# Altium project W2-HF_AMP.PrjPcb
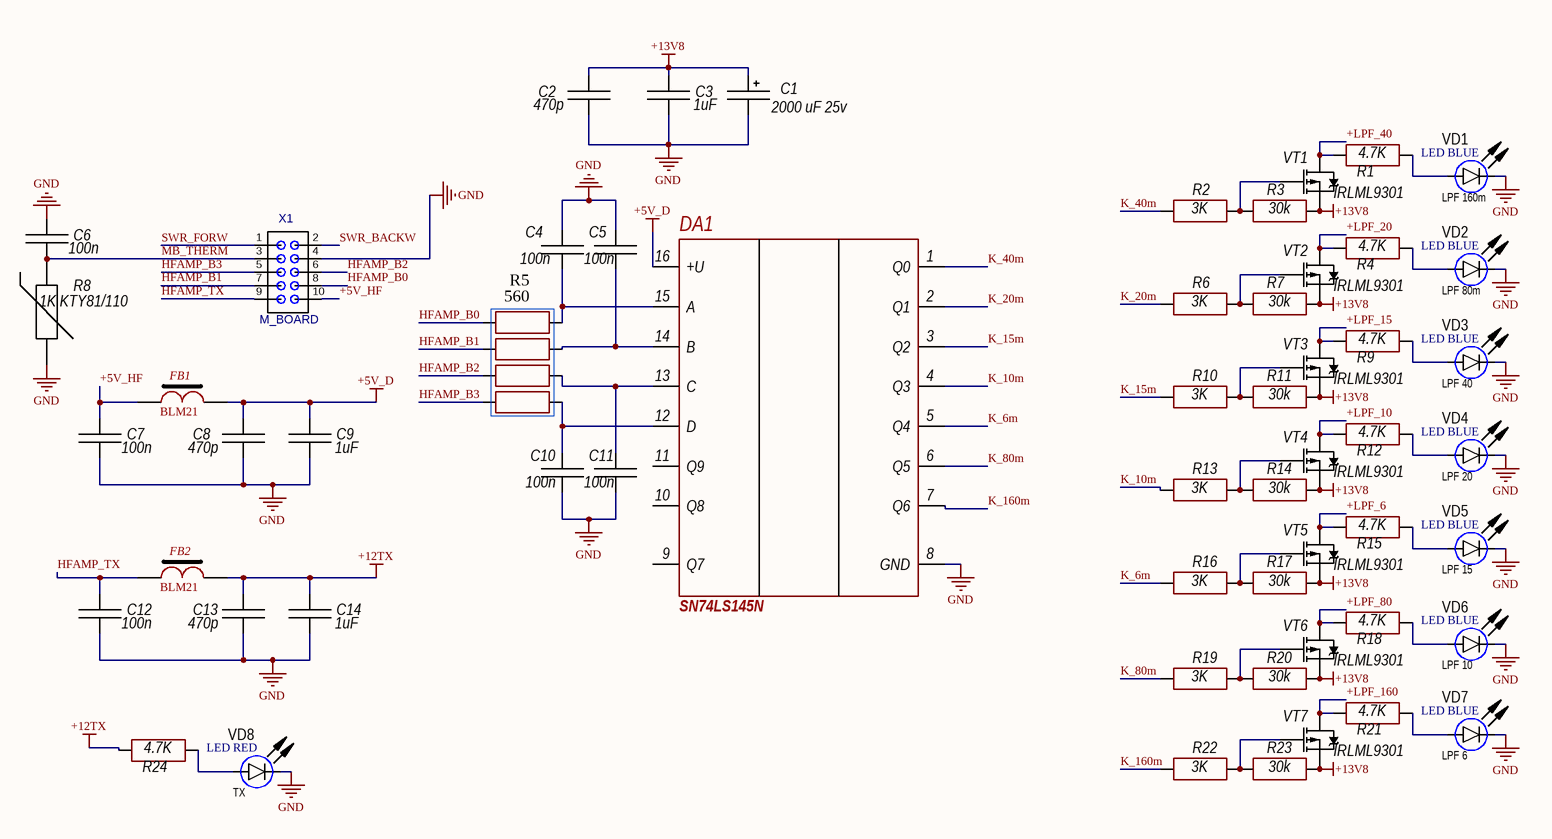
[diagram p0: HF_Control.SchDoc]
3 sheets, 274 parts. Net scope: global (net labels, ports and power ports of the same name join across sheets).
Board file: PCB_HFAmp.PcbDoc
Sheets:
  HF_Control.SchDoc
  HF_Amp.SchDoc
  HF_LPF.SchDoc

## Sheet HF_Control.SchDoc
size 420 x 297 mm; Date: 28.01.2023; ApprovedBy: UA3REO; CheckedBy: UA3REO; Author: RU4PN; CompanyName: Wolf Team; DocumentNumber: Wolf2 - HF Amp - Control; SheetNumber: 1; SheetTotal: 3

### Parts
C1  2000 uF 25v  [D13C5H20]
C2  470p  [CH0805C]
C3  1uF  [CH0805C]
C4  100n  [CH0805C]
C5  100n  [CH0805C]
C6  100n  [CH0805C]
C7  100n  [CH0805C]
C8  470p  [CH0805C]
C9  1uF  [CH0805C]
C10  100n  [CH0805C]
C11  100n  [CH0805C]
C12  100n  [CH0805C]
C13  470p  [CH0805C]
C14  1uF  [CH0805C]
DA1  SN74LS145N  [16-SOP]
FB1  BLM21  [CH0805L]
FB2  BLM21  [CH0805L]
R1  4.7K  [CH0805R]
R2  3K  [CH0805R]
R3  30k  [CH0805R]
R4  4.7K  [CH0805R]
R5  560  [CAT16]
R6  3K  [CH0805R]
R7  30k  [CH0805R]
R8  1K KTY81/110  [CON: PBS-2]
R9  4.7K  [CH0805R]
R10  3K  [CH0805R]
R11  30k  [CH0805R]
R12  4.7K  [CH0805R]
R13  3K  [CH0805R]
R14  30k  [CH0805R]
R15  4.7K  [CH0805R]
R16  3K  [CH0805R]
R17  30k  [CH0805R]
R18  4.7K  [CH0805R]
R19  3K  [CH0805R]
R20  30k  [CH0805R]
R21  4.7K  [CH0805R]
R22  3K  [CH0805R]
R23  30k  [CH0805R]
R24  4.7K  [CH0805R]
VD1  LED BLUE  Color: LPF 160m  [LED: 0805B]
VD2  LED BLUE  Color: LPF 80m  [LED: 0805B]
VD3  LED BLUE  Color: LPF 40  [LED: 0805B]
VD4  LED BLUE  Color: LPF 20  [LED: 0805B]
VD5  LED BLUE  Color: LPF 15  [LED: 0805B]
VD6  LED BLUE  Color: LPF 10  [LED: 0805B]
VD7  LED BLUE  Color: LPF 6  [LED: 0805B]
VD8  LED RED  Color: TX  [LED: 0805R]
VT1  IRLML9301  [SOT23_132]
VT2  IRLML9301  [SOT23_132]
VT3  IRLML9301  [SOT23_132]
VT4  IRLML9301  [SOT23_132]
VT5  IRLML9301  [SOT23_132]
VT6  IRLML9301  [SOT23_132]
VT7  IRLML9301  [SOT23_132]
X1  M_BOARD  [CON: BH-10]

### Nets
+5V_D: C8.1 C9.1 DA1.16(+U) FB1.1
+12TX: C13.1 C14.1 FB2.1 R24.2
+13V8: C1.1 C2.1 C3.1 R3.1 R7.1 R11.1 R14.1 R17.1 R20.1 R23.1 VT1.2(S) VT2.2(S) VT3.2(S) VT4.2(S) VT5.2(S) VT6.2(S) VT7.2(S)
GND: C1.2 C2.2 C3.2 C4.1 C5.1 C6.1 C7.2 C8.2 C9.2 C10.2 C11.2 C12.2 C13.2 C14.2 DA1.8(GND) R8.1 VD1.2(C) VD2.2(C) VD3.2(C) VD4.2(C) VD5.2(C) VD6.2(C) VD7.2(C) VD8.2(C) X1.4
+5V_HF: C7.1 FB1.2 X1.10
+LPF_6: R15.2 VT5.3(D)
+LPF_10: R12.2 VT4.3(D)
+LPF_15: R9.2 VT3.3(D)
+LPF_20: R4.2 VT2.3(D)
+LPF_40: R1.2 VT1.3(D)
+LPF_80: R18.2 VT6.3(D)
+LPF_160: R21.2 VT7.3(D)
HFAMP_B0: R5.1 X1.8
HFAMP_B1: R5.2 X1.7
HFAMP_B2: R5.3 X1.6
HFAMP_B3: R5.4 X1.5
HFAMP_TX: C12.1 FB2.2 X1.9
K_6m: DA1.5(Q4) R16.2
K_10m: DA1.4(Q3) R13.2
K_15m: DA1.3(Q2) R10.2
K_20m: DA1.2(Q1) R6.2
K_40m: DA1.1(Q0) R2.2
K_80m: DA1.6(Q5) R19.2
K_160m: DA1.7(Q6) R22.2
MB_THERM: C6.2 R8.2 X1.3
SWR_BACKW: X1.2
SWR_FORW: X1.1
NetC4_2: C4.2 DA1.15(A) R5.5
NetC5_2: C5.2 DA1.14(B) R5.6
NetC10_1: C10.1 DA1.12(D) R5.8
NetC11_1: C11.1 DA1.13(C) R5.7
NetR1_1: R1.1 VD1.1(A)
NetR2_1: R2.1 R3.2 VT1.1(G)
NetR4_1: R4.1 VD2.1(A)
NetR6_1: R6.1 R7.2 VT2.1(G)
NetR9_1: R9.1 VD3.1(A)
NetR10_1: R10.1 R11.2 VT3.1(G)
NetR12_1: R12.1 VD4.1(A)
NetR13_1: R13.1 R14.2 VT4.1(G)
NetR15_1: R15.1 VD5.1(A)
NetR16_1: R16.1 R17.2 VT5.1(G)
NetR18_1: R18.1 VD6.1(A)
NetR19_1: R19.1 R20.2 VT6.1(G)
NetR21_1: R21.1 VD7.1(A)
NetR22_1: R22.1 R23.2 VT7.1(G)
NetR24_1: R24.1 VD8.1(A)

Not connected (* = marked no-connect by the designer): DA1 9(Q7) 10(Q8) 11(Q9)

### Notes on the sheet
- Подп. и дата
- Инв. № дубл.
- Взам. инв. №
- Инв. № подл.
- Изм.
- Лист
- № докум.
- Подп.
- Дата
- 2.106-A3
- Копировал
- Формат А3

### Library data of the parts
C1 = AlumCap: Manufacturer: *; Model: *; HelpURL: *; ComponentKind: *; Value: *
C2-C14 = Capacitor: Manufacturer: *; Model: *; HelpURL: *; ComponentKind: *; Value: *
FB1 FB2 = FB-1
R1-R4 R6 R7 R9-R24 = Resistor: Manufacturer: *; Model: *; HelpURL: *; ComponentKind: *; Value: *
R5 = CAT10-0804
R8 = NTC: Manufacturer: *; Model: *; HelpURL: *; ComponentKind: *; Value: *
VD1-VD8 = LED_single: ValueManufacturerPartNumber: LED, *, *, *, -55...+150°C; Manufacturer: *; Package: *; HelpURL: *; Temperature: -55...+150°C; TypeDiode: LED; Current: *; VoltageDrop: *; PartNumber: *
VT1-VT7 = IRLML9301: Mosfet; Model: *; Manufacturer: *; ComponentKind: *; HelpURL: *
X1 = IDC10: 2*5 Pin

## Sheet HF_Amp.SchDoc
size 420 x 297 mm; Date: 28.01.2023; ApprovedBy: UA3REO; CheckedBy: UA3REO; Author: RU4PN; CompanyName: Wolf Team; DrawnBy: UA3REO; DocumentNumber: Wolf2 - HF Amp - Amp; SheetNumber: 2; SheetTotal: 3
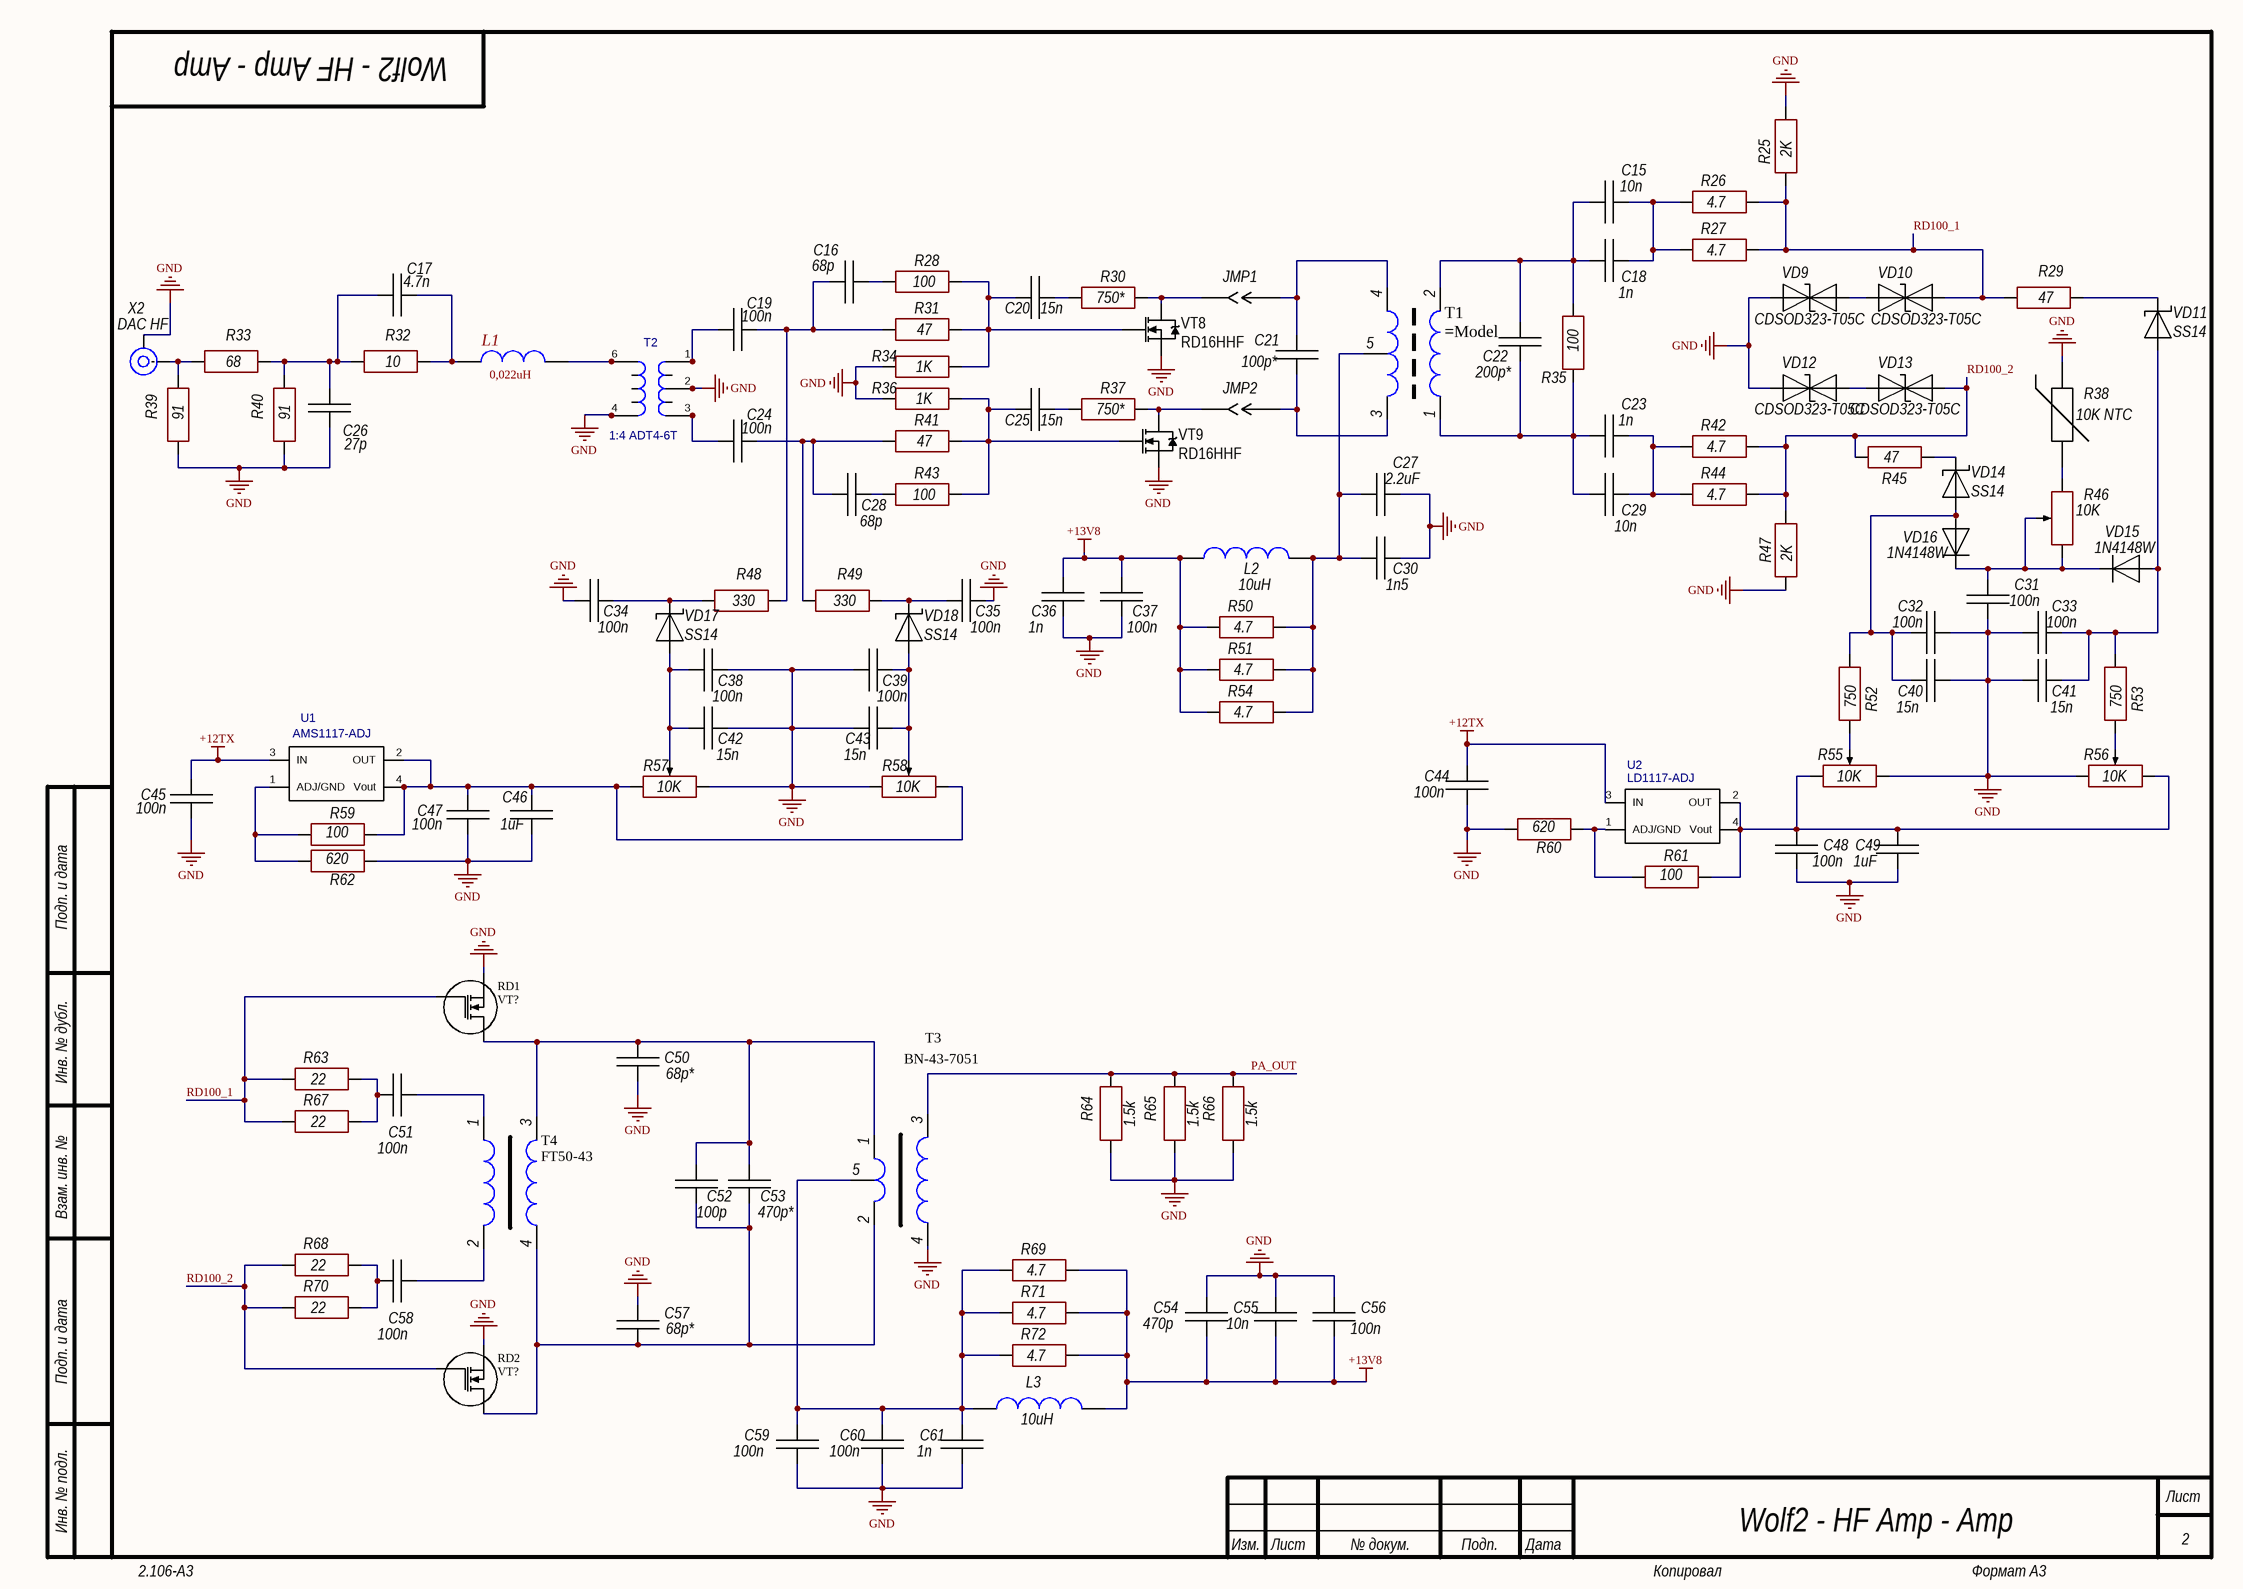
[diagram p1: HF_Amp.SchDoc]

### Parts
C15  10n  [CH1210C]
C16  68p  [CH0805C]
C17  4.7n  [CH0805C]
C18  1n  [CH1210C]
C19  100n  [CH0805C]
C20  15n  [CH1206C]
C21  100p*  [CH1210C]
C22  200p*  [CH1812C]
C23  1n  [CH1210C]
C24  100n  [CH0805C]
C25  15n  [CH1206C]
C26  27p  [CH0805C]
C27  2.2uF  [CH1206C]
C28  68p  [CH0805C]
C29  10n  [CH1210C]
C30  1n5  [CH1206C]
C31  100n  [CH0805C]
C32  100n  [CH0805C]
C33  100n  [CH0805C]
C34  100n  [CH0805C]
C35  100n  [CH0805C]
C36  1n  [CH0805C]
C37  100n  [CH0805C]
C38  100n  [CH0805C]
C39  100n  [CH0805C]
C40  15n  [CH0805C]
C41  15n  [CH0805C]
C42  15n  [CH0805C]
C43  15n  [CH0805C]
C44  100n  [CH0805C]
C45  100n  [CH0805C]
C46  1uF  [CH0805C]
C47  100n  [CH0805C]
C48  100n  [CH0805C]
C49  1uF  [CH0805C]
C50  68p*  [CH1206ATC]
C51  100n  [CH1210C]
C52  100p  [CH1812C]
C53  470p*  [CH1812C]
C54  470p  [CH1206C]
C55  10n  [CH1206C]
C56  100n  [CH1206C]
C57  68p*  [CH1206ATC]
C58  100n  [CH1210C]
C59  100n  [CH1206C]
C60  100n  [CH1206C]
C61  1n  [CH1206C]
JMP1  Jumper_2  [CON: JUMPER_2]  (value not drawn)
JMP2  Jumper_2  [CON: JUMPER_2]  (value not drawn)
L1  0,022uH  [CH1210L]
L2  10uH  [IND: R24]
L3  10uH  [IND: R24]
R25  2K  [CH2512R]
R26  4.7  [CH2512R]
R27  4.7  [CH2512R]
R28  100  [CH0805R]
R29  47  [CH0805R]
R30  750*  [CH1206R]
R31  47  [CH0805R]
R32  10  [CH0805R]
R33  68  [CH0805R]
R34  1K  [CH0805R]
R35  100  [CH2512R]
R36  1K  [CH0805R]
R37  750*  [CH1206R]
R38  10K NTC  [CON: PBS-2]
R39  91  [CH0805R]
R40  91  [CH0805R]
R41  47  [CH0805R]
R42  4.7  [CH2512R]
R43  100  [CH0805R]
R44  4.7  [CH2512R]
R45  47  [CH0805R]
R46  10K  [RES: 3296W]
R47  2K  [CH2512R]
R48  330  [CH0805R]
R49  330  [CH0805R]
R50  4.7  [CH2512R]
R51  4.7  [CH2512R]
R52  750  [CH0805R]
R53  750  [CH0805R]
R54  4.7  [CH2512R]
R55  10K  [RES: 3296W]
R56  10K  [RES: 3296W]
R57  10K  [RES: 3296W]
R58  10K  [RES: 3296W]
R59  100  [CH0805R]
R60  620  [CH0805R]
R61  100  [CH0805R]
R62  620  [CH0805R]
R63  22  [CH2512R]
R64  1.5k  [R-DIP]
R65  1.5k  [R-DIP]
R66  1.5k  [R-DIP]
R67  22  [CH2512R]
R68  22  [CH2512R]
R69  4.7  [CH2512R]
R70  22  [CH2512R]
R71  4.7  [CH2512R]
R72  4.7  [CH2512R]
RD1  VT?  [RD100]
RD2  VT?  [RD100]
T1  (no value)  [BN43-202-RD16]
T2  1:4 ADT4-6T  [TRANSF_ACORE2]
T3  BN-43-7051  [BN61-002-V1]
T4  FT50-43  [TRANS OS W2]
U1  value AMS1117-ADJ  [LT1117CST-3.3]  (hidden comment: 1117-ADJ)
U2  value LD1117-ADJ  [LT1117CST-3.3_2]  (hidden comment: 1117-ADJ)
VD9  CDSOD323-T05C  [SOD323]
VD10  CDSOD323-T05C  [SOD323]
VD11  SS14  [SMA]
VD12  CDSOD323-T05C  [SOD323]
VD13  CDSOD323-T05C  [SOD323]
VD14  SS14  [SMA]
VD15  1N4148W  [SOD123]
VD16  1N4148W  [SOD123]
VD17  SS14  [SMA]
VD18  SS14  [SMA]
VT8  PartNumber: RD16HHF  [rd16]
VT9  PartNumber: RD16HHF  [rd16]
X2  DAC HF  [CON: SMA]

### Nets
+12TX: C44.1 C45.1 U1.3(IN) U2.3(IN)
+13V8: C36.1 C37.1 C54.1 C55.1 C56.1 L2.2 L3.1 R50.2 R51.2 R54.2 R69.1 R71.1 R72.1
GND: C26.1 C27.2 C30.2 C31.2 C32.1 C33.2 C34.2 C35.1 C36.2 C37.2 C38.1 C39.2 C40.1 C41.2 C42.1 C43.2 C44.2 C45.2 C46.2 C47.2 C48.2 C49.2 C50.1 C54.2 C55.2 C56.2 C57.2 C59.1 C60.1 C61.1 R25.1 R34.2 R36.2 R38.2 R39.2 R40.2 R47.2 R55.3 R56.1 R57.3 R58.1 R60.2 R62.1 R64.1 R65.1 R66.1 RD1.2(S) RD2.2(S) T2.2(S2) T2.4(P1) T2.8 T2.11 T3.4 VD9.1(A) VD12.1(A) VT8.2(S) VT9.2(S) X2.2(IN)
PA_OUT: R64.2 R65.2 R66.2 T3.3
RD100_1: R25.2 R26.1 R27.1 R29.2 R63.2 R67.2 RD1.3(G) VD10.2(C)
RD100_2: R42.1 R44.1 R45.1 R47.1 R68.2 R70.2 RD2.3(G) VD13.2(C)
NetC15_1: C15.1 C18.1 C22.1 R35.1 T1.2
NetC15_2: C15.2 C18.2 R26.2 R27.2
NetC16_1: C16.1 R28.2
NetC16_2: C16.2 C19.2 R31.2 R48.1
NetC17_1: C17.1 C26.2 R32.2 R33.1 R40.1
NetC17_2: C17.2 L1.2 R32.1
NetC19_1: C19.1 T2.1(S3) T2.7
NetC20_1: C20.1 R30.2
NetC20_2: C20.2 R28.1 R31.1 R34.1 VT8.1(G)
NetC21_1: C21.1 JMP1.2(OUT) T1.4
NetC21_2: C21.2 JMP2.2(OUT) T1.3
NetC22_2: C22.2 C23.1 C29.1 R35.2 T1.1
NetC23_2: C23.2 C29.2 R42.2 R44.2
NetC24_1: C24.1 T2.3(S1) T2.9
NetC24_2: C24.2 C28.2 R41.2 R49.2
NetC25_1: C25.1 R37.2
NetC25_2: C25.2 R36.1 R41.1 R43.1 VT9.1(G)
NetC27_1: C27.1 C30.1 L2.1 R50.1 R51.1 R54.1 T1.5
NetC28_1: C28.1 R43.2
NetC31_1: C31.1 R46.1 R46.2 VD15.2 VD16.2
NetC32_2: C32.2 C40.2 R52.1 VD14.1 VD16.1
NetC33_1: C33.1 C41.1 R53.1 VD11.1 VD15.1
NetC34_1: C34.1 R48.2 VD17.2
NetC35_2: C35.2 R49.1 VD18.2
NetC38_2: C38.2 C42.2 R57.2 VD17.1
NetC39_1: C39.1 C43.1 R58.2 VD18.1
NetC46_1: C46.1 C47.1 R57.1 R58.3 R59.1 U1.2(OUT) U1.4(Vout)
NetC48_1: C48.1 C49.1 R55.1 R56.3 R61.1 U2.2(OUT) U2.4(Vout)
NetC50_2: C50.2 C52.2 C53.2 RD1.1(D) T3.1 T4.3
NetC51_1: C51.1 R63.1 R67.1
NetC51_2: C51.2 T4.1
NetC52_1: C52.1 C53.1 C57.1 RD2.1(D) T3.2 T4.4
NetC58_1: C58.1 R68.1 R70.1
NetC58_2: C58.2 T4.2
NetC59_2: C59.2 C60.2 C61.2 L3.2 R69.2 R71.2 R72.2 T3.5
NetJMP1_1: JMP1.1(IN) R30.1 VT8.3(D)
NetJMP2_1: JMP2.1(IN) R37.1 VT9.3(D)
NetL1_1: L1.1 T2.6(P2) T2.10
NetR29_1: R29.1 VD11.2
NetR33_2: R33.2 R39.1 X2.1(IN)
NetR38_1: R38.1 R46.3
NetR45_2: R45.2 VD14.2
NetR52_2: R52.2 R55.2
NetR53_2: R53.2 R56.2
NetR59_2: R59.2 R62.2 U1.1(ADJ/GND)
NetR60_1: R60.1 R61.2 U2.1(ADJ/GND)
NetVD9_2: VD9.2(C) VD10.1(A)
NetVD12_2: VD12.2(C) VD13.1(A)

### Notes on the sheet
- Подп. и дата
- Инв. № дубл.
- Взам. инв. №
- Инв. № подл.
- Изм.
- Лист
- № докум.
- Подп.
- Дата
- 2.106-A3
- Копировал
- Формат А3

### Library data of the parts
C15-C61 = Capacitor: Manufacturer: *; Model: *; HelpURL: *; ComponentKind: *; Value: *
JMP1 JMP2 = Jumper_2: Jumper
L1 = Inductor-2
L2 L3 = Inductor ring: Value: {Value}; Model: *; ComponentKind: *; Manufacturer: *; HelpURL: *
R25-R37 R39-R45 R47-R54 R59-R72 = Resistor: Manufacturer: *; Model: *; HelpURL: *; ComponentKind: *; Value: *
R38 = NTC: Manufacturer: *; Model: *; HelpURL: *; ComponentKind: *; Value: *
R46 R55-R58 = ADJ resistor: Manufacturer: *; Model: *; HelpURL: *; ComponentKind: *; Value: *
RD1 = N-1
RD2 = N-1: RD100
T1 = TRANS-RD16
T2 = TRANSF_ACORE2: Transformer; Value: 1:4 ADT4-6T
T3 = BN-43-7051_1
T4 = Trans_L
U1 U2 = LT1117CST-3.3: LT1117CST-ADJ
VD9 VD10 VD12 VD13 = TVS-diod: ComponentKind: *; Manufacturer: *; Model: *; HelpURL: *
VD11 VD14 VD17 VD18 = Diod Schottky: ComponentKind: *; Manufacturer: *; Model: *; HelpURL: *
VD15 VD16 = Diod: ComponentKind: *; Manufacturer: *; Model: *; HelpURL: *
VT8 VT9 = MOSFET_N_132: Manufacturer: Infineon Technologies; ValueManufacturerPartNumber: MOSFET N-channel transistor, 80V, 7A, 9.1nC, 2.5W, 34mOhm, 756pF, 8-TDSON, -55...+150°C; TypeTransistor: MOSFET N-channel transistor; VoltageDS: 80V; CurrentDS: 7A; RDS: 34mOhm; GateCharge: 9.1nC; InputCapacitor: 756pF; MaxPower: 2.5W; Package: 8-TDSON; HelpURL: https://www.digikey.com/product-detail/en/infineon-technologies/BSC340N08NS3GATMA1/BSC340N08NS3GATMA1TR-ND/2080655; Temperature: -55...+150°C
X2 = SMA: RF; Model: *; Manufacturer: *; HelpURL: *; ComponentKind: *

## Sheet HF_LPF.SchDoc: PA HF
size 420 x 297 mm; Date: 19.02.2023; ApprovedBy: UA3REO; CheckedBy: UA3REO; Author: RU4PN; CompanyName: WolfTeam; DrawnBy: UA3REO; Engineer: UA3REO; Address1: 1; Address2: 2; Address3: 3; Address4: 4; DocumentNumber: W2 - HF AMP  - LPF; Revision: 0.1; SheetNumber: 3; SheetTotal: 3
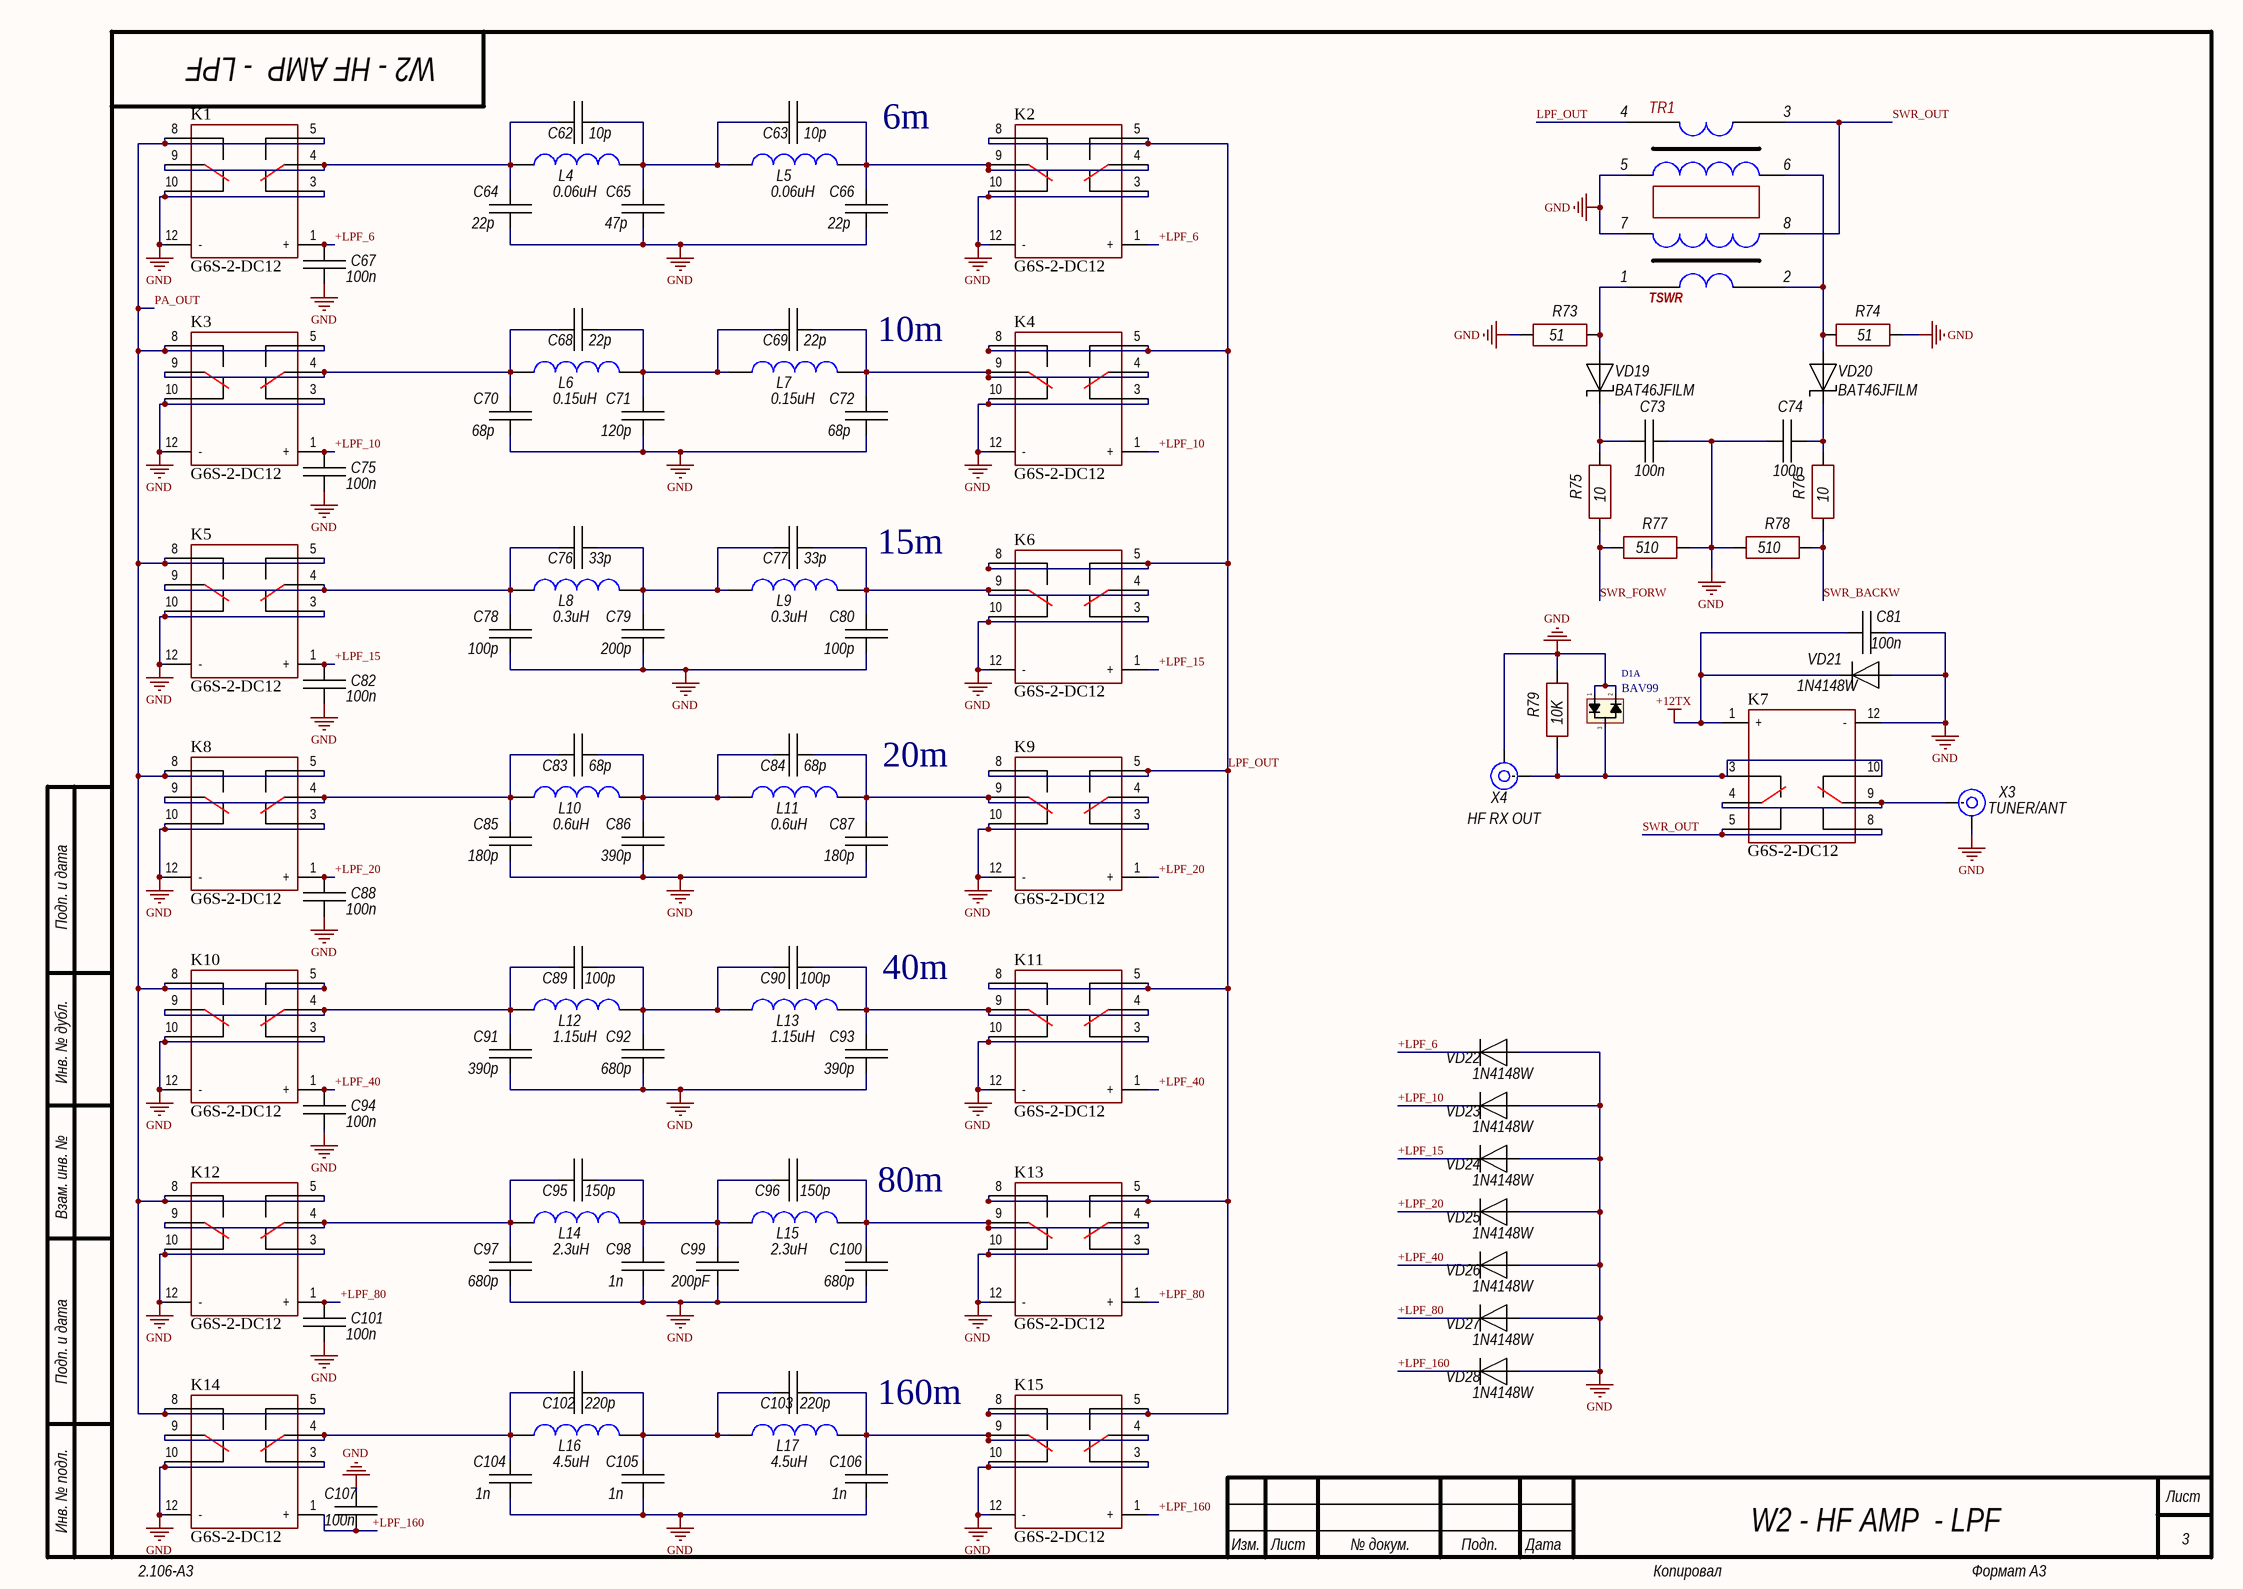
[diagram p2: HF_LPF.SchDoc]

### Parts
C62  10p  [CH1206ATC]
C63  10p  [CH1206ATC]
C64  22p  [CH1206ATC]
C65  47p  [CH1206ATC]
C66  22p  [CH1206ATC]
C67  100n  [CH0805C]
C68  22p  [CH1206ATC]
C69  22p  [CH1206ATC]
C70  68p  [CH1206ATC]
C71  120p  [CH1206ATC]
C72  68p  [CH1206ATC]
C73  100n  [CH1206C]
C74  100n  [CH1206C]
C75  100n  [CH0805C]
C76  33p  [CH1206ATC]
C77  33p  [CH1206ATC]
C78  100p  [CH1206ATC]
C79  200p  [CH1206ATC]
C80  100p  [CH1206ATC]
C81  100n  [CH1206C]
C82  100n  [CH0805C]
C83  68p  [CH1206ATC]
C84  68p  [CH1206ATC]
C85  180p  [CH1206ATC]
C86  390p  [CH1206ATC]
C87  180p  [CH1206ATC]
C88  100n  [CH0805C]
C89  100p  [CH1206ATC]
C90  100p  [CH1206ATC]
C91  390p  [CH1206ATC]
C92  680p  [CH1206ATC]
C93  390p  [CH1206ATC]
C94  100n  [CH0805C]
C95  150p  [CH1206ATC]
C96  150p  [CH1206ATC]
C97  680p  [CH1206ATC]
C98  1n  [CH1206ATC]
C99  200pF  [CH1206ATC]
C100  680p  [CH1206ATC]
C101  100n  [CH0805C]
C102  220p  [CH1206ATC]
C103  220p  [CH1206ATC]
C104  1n  [CH1206ATC]
C105  1n  [CH1206ATC]
C106  1n  [CH1206ATC]
C107  100n  [CH0805C]
D1  BAV99  [SOT23_132]  (part A of 2)
K1  G6S-2-DC12  [G6S-2-DC12]
K2  G6S-2-DC12  [G6S-2-DC12]
K3  G6S-2-DC12  [G6S-2-DC12]
K4  G6S-2-DC12  [G6S-2-DC12]
K5  G6S-2-DC12  [G6S-2-DC12]
K6  G6S-2-DC12  [G6S-2-DC12]
K7  G6S-2-DC12  [G6S-2-DC12]
K8  G6S-2-DC12  [G6S-2-DC12]
K9  G6S-2-DC12  [G6S-2-DC12]
K10  G6S-2-DC12  [G6S-2-DC12]
K11  G6S-2-DC12  [G6S-2-DC12]
K12  G6S-2-DC12  [G6S-2-DC12]
K13  G6S-2-DC12  [G6S-2-DC12]
K14  G6S-2-DC12  [G6S-2-DC12]
K15  G6S-2-DC12  [G6S-2-DC12]
L4  0.06uH  [DR1]
L5  0.06uH  [DR1]
L6  0.15uH  [DR1]
L7  0.15uH  [DR1]
L8  0.3uH  [T68-0]
L9  0.3uH  [T68-0]
L10  0.6uH  [T68-0]
L11  0.6uH  [T68-0]
L12  1.15uH  [T68-0]
L13  1.15uH  [T68-0]
L14  2.3uH  [T68-0]
L15  2.3uH  [T68-0]
L16  4.5uH  [T68-0]
L17  4.5uH  [T68-0]
R73  51  [CH1206R]
R74  51  [CH1206R]
R75  10  [CH0805R]
R76  10  [CH0805R]
R77  510  [CH0805R]
R78  510  [CH0805R]
R79  10K  [CH2512R]
TR1  TSWR  [TANDEM]
VD19  BAT46JFILM  [SOD323]
VD20  BAT46JFILM  [SOD323]
VD21  1N4148W  [SOD123]
VD22  1N4148W  [SOD123]
VD23  1N4148W  [SOD123]
VD24  1N4148W  [SOD123]
VD25  1N4148W  [SOD123]
VD26  1N4148W  [SOD123]
VD27  1N4148W  [SOD123]
VD28  1N4148W  [SOD123]
X3  TUNER/ANT  [CON: SMA]
X4  HF RX OUT  [CON: SMA]

### Nets
+12TX: C81.1 K7.1(+) VD21.2
GND: C64.1 C65.1 C66.1 C67.2 C70.1 C71.1 C72.1 C73.2 C74.1 C75.2 C78.1 C79.1 C80.1 C81.2 C82.2 C85.1 C86.1 C87.1 C88.2 C91.1 C92.1 C93.1 C94.2 C97.1 C98.1 C99.1 C100.1 C101.2 C104.1 C105.1 C106.1 C107.1 D1.1 D1.2 K1.3(NC_1) K1.10(NC_2) K1.12(-) K2.3(NC_1) K2.10(NC_2) K2.12(-) K3.3(NC_1) K3.10(NC_2) K3.12(-) K4.3(NC_1) K4.10(NC_2) K4.12(-) K5.3(NC_1) K5.10(NC_2) K5.12(-) K6.3(NC_1) K6.10(NC_2) K6.12(-) K7.12(-) K8.3(NC_1) K8.10(NC_2) K8.12(-) K9.3(NC_1) K9.10(NC_2) K9.12(-) K10.3(NC_1) K10.10(NC_2) K10.12(-) K11.3(NC_1) K11.10(NC_2) K11.12(-) K12.3(NC_1) K12.10(NC_2) K12.12(-) K13.3(NC_1) K13.10(NC_2) K13.12(-) K14.3(NC_1) K14.10(NC_2) K14.12(-) K15.3(NC_1) K15.10(NC_2) K15.12(-) R73.1 R74.2 R77.2 R78.1 R79.2 TR1.5 TR1.7 VD21.1 VD22.1 VD23.1 VD24.1 VD25.1 VD26.1 VD27.1 VD28.1 X3.2(IN) X4.2(IN)
+LPF_6: C67.1 K1.1(+) K2.1(+) VD22.2
+LPF_10: C75.1 K3.1(+) K4.1(+) VD23.2
+LPF_15: C82.1 K5.1(+) K6.1(+) VD24.2
+LPF_20: C88.1 K8.1(+) K9.1(+) VD25.2
+LPF_40: C94.1 K10.1(+) K11.1(+) VD26.2
+LPF_80: C101.1 K12.1(+) K13.1(+) VD27.2
+LPF_160: C107.2 K14.1(+) K15.1(+) VD28.2
LPF_OUT: K2.5(NO_1) K2.8(NO_2) K4.5(NO_1) K4.8(NO_2) K6.5(NO_1) K6.8(NO_2) K9.5(NO_1) K9.8(NO_2) K11.5(NO_1) K11.8(NO_2) K13.5(NO_1) K13.8(NO_2) K15.5(NO_1) K15.8(NO_2) TR1.4
PA_OUT: K1.5(NO_1) K1.8(NO_2) K3.5(NO_1) K3.8(NO_2) K5.5(NO_1) K5.8(NO_2) K8.5(NO_1) K8.8(NO_2) K10.5(NO_1) K10.8(NO_2) K12.5(NO_1) K12.8(NO_2) K14.5(NO_1) K14.8(NO_2)
SWR_BACKW: R76.1 R78.2
SWR_FORW: R75.1 R77.1
SWR_OUT: K7.5(NO_1) K7.8(NO_2) TR1.3 TR1.8
NetC62_1: C62.1 C63.2 C65.2 L4.1 L5.2
NetC62_2: C62.2 C64.2 K1.4(COM_1) K1.9(COM_2) L4.2
NetC63_1: C63.1 C66.2 K2.4(COM_1) K2.9(COM_2) L5.1
NetC68_1: C68.1 C69.2 C71.2 L6.1 L7.2
NetC68_2: C68.2 C70.2 K3.4(COM_1) K3.9(COM_2) L6.2
NetC69_1: C69.1 C72.2 K4.4(COM_1) K4.9(COM_2) L7.1
NetC73_1: C73.1 R75.2 VD19.2
NetC74_2: C74.2 R76.2 VD20.2
NetC76_1: C76.1 C77.2 C79.2 L8.1 L9.2
NetC76_2: C76.2 C78.2 K5.4(COM_1) K5.9(COM_2) L8.2
NetC77_1: C77.1 C80.2 K6.4(COM_1) K6.9(COM_2) L9.1
NetC83_1: C83.1 C84.2 C86.2 L10.1 L11.2
NetC83_2: C83.2 C85.2 K8.4(COM_1) K8.9(COM_2) L10.2
NetC84_1: C84.1 C87.2 K9.4(COM_1) K9.9(COM_2) L11.1
NetC89_1: C89.1 C90.2 C92.2 L12.1 L13.2
NetC89_2: C89.2 C91.2 K10.4(COM_1) K10.9(COM_2) L12.2
NetC90_1: C90.1 C93.2 K11.4(COM_1) K11.9(COM_2) L13.1
NetC95_1: C95.1 C96.2 C98.2 C99.2 L14.1 L15.2
NetC95_2: C95.2 C97.2 K12.4(COM_1) K12.9(COM_2) L14.2
NetC96_1: C96.1 C100.2 K13.4(COM_1) K13.9(COM_2) L15.1
NetC102_1: C102.1 C103.2 C105.2 L16.1 L17.2
NetC102_2: C102.2 C104.2 K14.4(COM_1) K14.9(COM_2) L16.2
NetC103_1: C103.1 C106.2 K15.4(COM_1) K15.9(COM_2) L17.1
NetD1_3: D1.3 K7.3(NC_1) K7.10(NC_2) R79.1 X4.1(IN)
NetK7_4: K7.4(COM_1) K7.9(COM_2) X3.1(IN)
NetR73_2: R73.2 TR1.1 VD19.1
NetR74_1: R74.1 TR1.2 TR1.6 VD20.1

### Notes on the sheet
- 6m
- 10m
- 15m
- 20m
- 40m
- 80m
- 160m
- Подп. и дата
- Инв. № дубл.
- Взам. инв. №
- Инв. № подл.
- Изм.
- Лист
- № докум.
- Подп.
- Дата
- 2.106-A3
- Копировал
- Формат А3

### Library data of the parts
C62-C107 = Capacitor: Manufacturer: *; Model: *; HelpURL: *; ComponentKind: *; Value: *
K1-K15 = G6S-2-DC12V_2
L4-L17 = Inductor ring: Value: {Value}; Model: *; ComponentKind: *; Manufacturer: *; HelpURL: *
R73-R79 = Resistor: Manufacturer: *; Model: *; HelpURL: *; ComponentKind: *; Value: *
TR1 = BN43-302
VD19 VD20 = Diod Schottky: ComponentKind: *; Manufacturer: *; Model: *; HelpURL: *
VD21-VD28 = Diod: ComponentKind: *; Manufacturer: *; Model: *; HelpURL: *
X3 X4 = SMA: RF; Model: *; Manufacturer: *; HelpURL: *; ComponentKind: *

## Nets that join several sheets
+12TX: HF_Control (C13.1 C14.1 FB2.1 R24.2), HF_Amp (C44.1 C45.1 U1.3 U2.3), HF_LPF (C81.1 K7.1 VD21.2)
+13V8: HF_Control (17 pins), HF_Amp (13 pins)
GND: HF_Control (25 pins), HF_Amp (58 pins), HF_LPF (94 pins)
+LPF_6: HF_Control (R15.2 VT5.3), HF_LPF (C67.1 K1.1 K2.1 VD22.2)
+LPF_10: HF_Control (R12.2 VT4.3), HF_LPF (C75.1 K3.1 K4.1 VD23.2)
+LPF_15: HF_Control (R9.2 VT3.3), HF_LPF (C82.1 K5.1 K6.1 VD24.2)
+LPF_20: HF_Control (R4.2 VT2.3), HF_LPF (C88.1 K8.1 K9.1 VD25.2)
+LPF_40: HF_Control (R1.2 VT1.3), HF_LPF (C94.1 K10.1 K11.1 VD26.2)
+LPF_80: HF_Control (R18.2 VT6.3), HF_LPF (C101.1 K12.1 K13.1 VD27.2)
+LPF_160: HF_Control (R21.2 VT7.3), HF_LPF (C107.2 K14.1 K15.1 VD28.2)
PA_OUT: HF_Amp (R64.2 R65.2 R66.2 T3.3), HF_LPF (14 pins)
SWR_BACKW: HF_Control (X1.2), HF_LPF (R76.1 R78.2)
SWR_FORW: HF_Control (X1.1), HF_LPF (R75.1 R77.1)